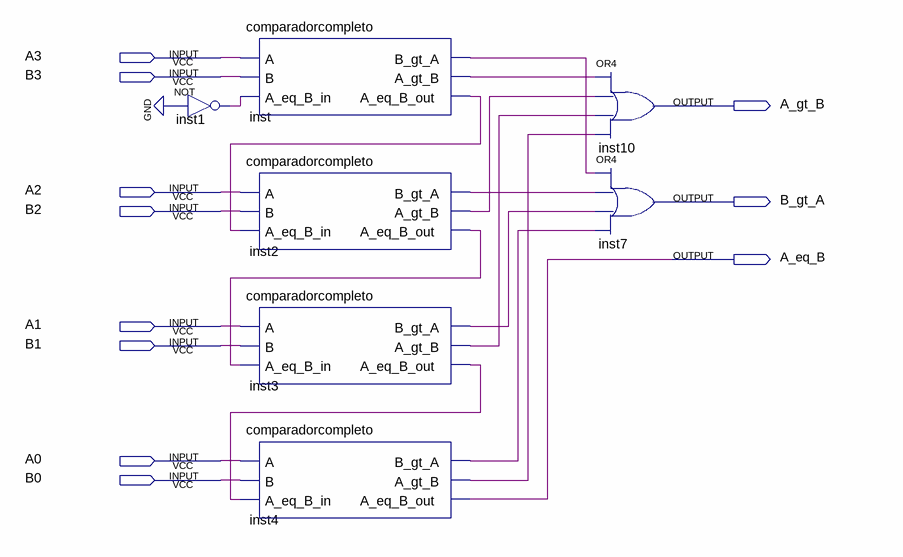
[diagram p0: schematic sheet]
// Quartus schematic comparadorquatrobits.bdf as structural Verilog: 7 symbols, 11 pins
module comparadorquatrobits (
  input  A3,
  input  B3,
  input  A2,
  input  B2,
  input  A1,
  input  B1,
  input  A0,
  input  B0,
  output A_gt_B,
  output B_gt_A,
  output A_eq_B
);

  wire inst1_out, inst2_a_eq_b_out, inst2_a_gt_b, inst2_b_gt_a, inst3_a_eq_b_out, inst3_a_gt_b, inst3_b_gt_a,
       inst4_a_gt_b, inst4_b_gt_a, inst_a_eq_b_out, inst_a_gt_b, inst_b_gt_a;

  not inst1 (inst1_out, 1'b0);
  comparadorcompleto inst (
    .A(A3), .B(B3), .A_eq_B_in(inst1_out), .B_gt_A(inst_b_gt_a), .A_gt_B(inst_a_gt_b),
    .A_eq_B_out(inst_a_eq_b_out));
  comparadorcompleto inst2 (
    .A(A2), .B(B2), .A_eq_B_in(inst_a_eq_b_out), .B_gt_A(inst2_b_gt_a), .A_gt_B(inst2_a_gt_b),
    .A_eq_B_out(inst2_a_eq_b_out));
  comparadorcompleto inst3 (
    .A(A1), .B(B1), .A_eq_B_in(inst2_a_eq_b_out), .B_gt_A(inst3_b_gt_a), .A_gt_B(inst3_a_gt_b),
    .A_eq_B_out(inst3_a_eq_b_out));
  comparadorcompleto inst4 (
    .A(A0), .B(B0), .A_eq_B_in(inst3_a_eq_b_out), .B_gt_A(inst4_b_gt_a), .A_gt_B(inst4_a_gt_b),
    .A_eq_B_out(A_eq_B));
  or inst10 (A_gt_B, inst_a_gt_b, inst2_a_gt_b, inst3_a_gt_b, inst4_a_gt_b);
  or inst7 (B_gt_A, inst_b_gt_a, inst2_b_gt_a, inst3_b_gt_a, inst4_b_gt_a);
endmodule
